# Altium schematic sheet iTag4.SchDoc
size A3
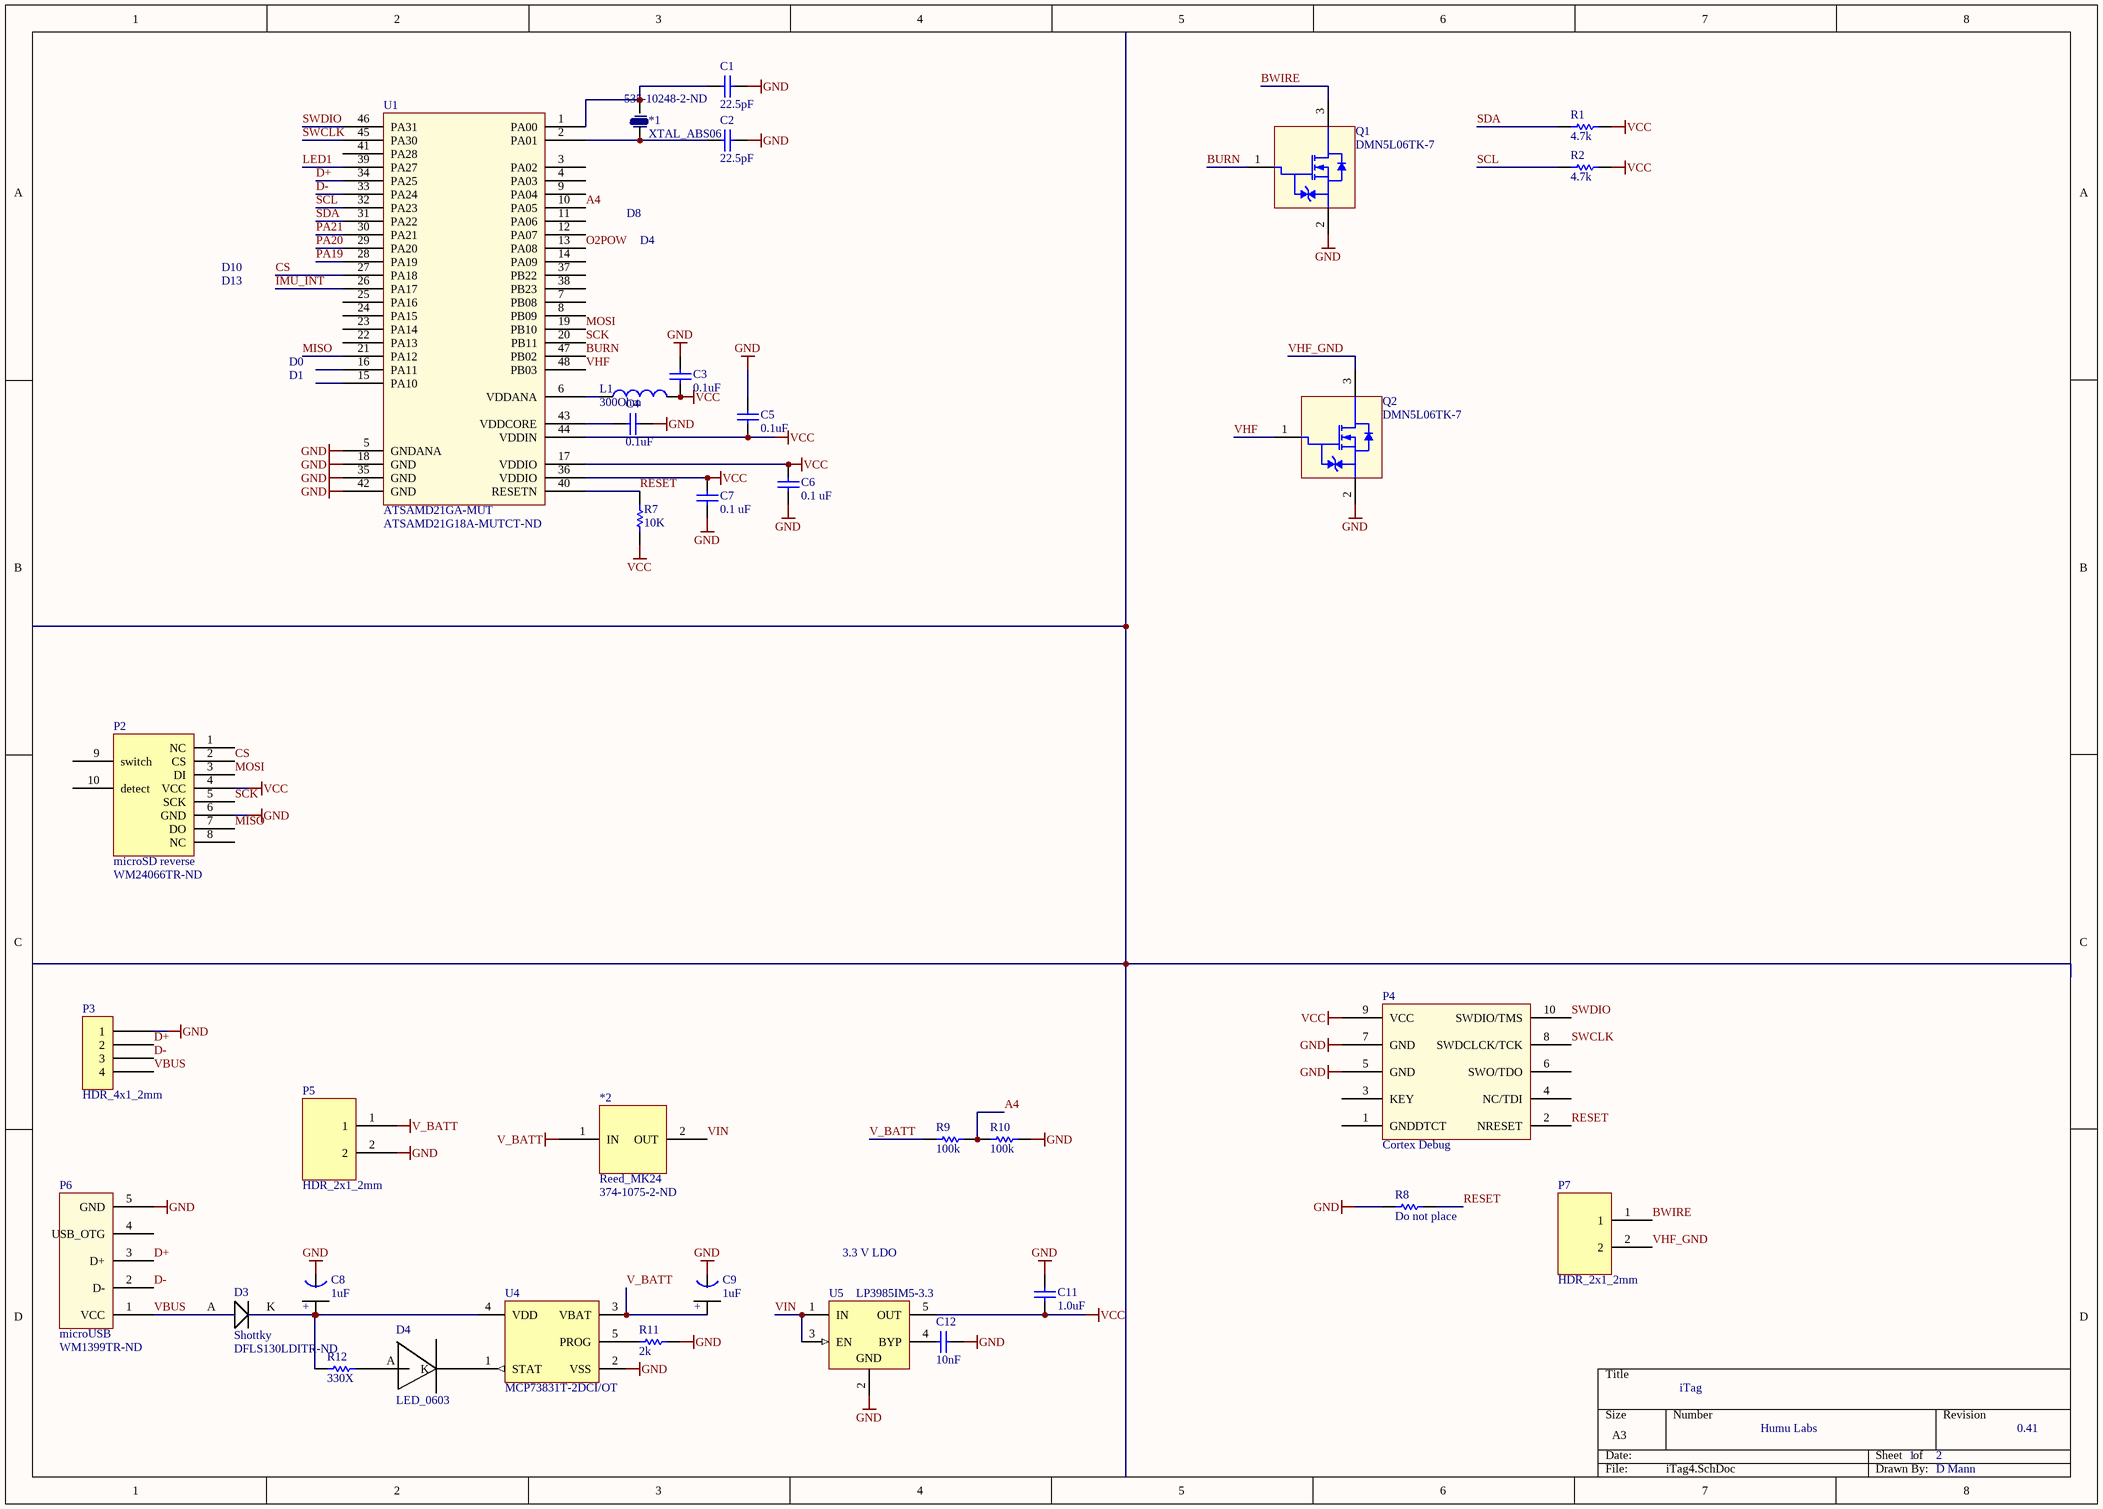
[diagram p0: iTag4.SchDoc]

## Parts
*1  XTAL_ABS06  Supplier Part Number 1: 535-10248-2-ND  [XTAL-ABS06]
*2  Reed_MK24  Supplier Part Number 1: 374-1075-2-ND  [Reed MK24-B-3]
C1  22.5pF  [0402]
C2  22.5pF  [0402]
C3  0.1uF  [0402]
C4  0.1uF  [0402]
C5  0.1uF  [0402]
C6  0.1 uF  [0402]
C7  0.1 uF  [0402]
C8  1uF  [Tant0805]
C9  1uF  [Tant0805]
C11  1.0uF  [0402]
C12  10nF  [0402]
D3  Shottky  Supplier Part Number 1: DFLS130LDITR-ND  [DFLS130]
D4  LED_0603  [Diode0603]
L1  300Ohm  [0805 (M2125) Ferrite]
P2  microSD reverse  Supplier Part Number 1: WM24066TR-ND  [miroSD_reverse]
P3  HDR_4x1_2mm  [Hdr_4x1_2mm]
P4  Cortex Debug  [Header_2x5_50mil]
P5  HDR_2x1_2mm  [HDR_2x1_2mm]
P6  microUSB  Supplier Part Number 1: WM1399TR-ND  [microUSB-B]
P7  HDR_2x1_2mm  [HDR_2x1_2mm]
Q1  DMN5L06TK-7  [SOT-523]
Q2  DMN5L06TK-7  [SOT-523]
R1  4.7k  [3-0603]
R2  4.7k  [3-0603]
R7  10K  [3-0603]
R8  Do not place  [3-0603]
R9  100k  [3-0603]
R10  100k  [3-0603]
R11  2k  [3-0603]
R12  330X  [3-0603]
U1  ATSAMD21GA-MUT  Supplier Part Number 1: ATSAMD21G18A-MUTCT-ND  [QFN127P600-8N]
U4  MCP73831T-2DCI/OT  [SOT-23-OT5_N]
U5  LP3985IM5-3.3  [MF05A_N]

## Nets
GND: C1.1 C2.1 C3.2 C4.2 C5.2 C6.2 C7.2 C8.1(GND) C9.1(GND) C11.2 C12.1 P2.6(GND) P3.1 P4.5(GND) P4.7(GND) P5.2 P6.5(GND) Q1.2(S) Q2.2(S) R8.2 R10.1 R11.1 U1.5(GNDANA) U1.18(GND) U1.35(GND) U1.42(GND) U4.2(VSS) U5.2(GND)
V_BATT: *2.1(IN) C9.2(+) P5.1 R9.2 U4.3(VBAT)
VCC: C3.1 C5.1 C6.1 C7.1 C11.1 L1.2 P2.4(VCC) P4.9(VCC) R1.1 R2.2 R7.1 U1.17(VDDIO) U1.36(VDDIO) U1.44(VDDIN) U5.5(OUT)
A4: R9.1 R10.2 U1.10(PA05)
BURN: Q1.1(G) U1.47(PB02)
BWIRE: P7.1 Q1.3(D)
CS: P2.2(CS) U1.27(PA18)
D+: P3.2 P6.3(D+) U1.34(PA25)
D-: P3.3 P6.2(D-) U1.33(PA24)
IMU_INT: U1.26(PA17)
LED1: U1.39(PA27)
MISO: P2.7(DO) U1.21(PA12)
MOSI: P2.3(DI) U1.19(PB10)
O2POW: U1.13(PA08)
PA19: U1.28(PA19)
PA20: U1.29(PA20)
PA21: U1.30(PA21)
RESET: P4.2(NRESET) R7.2 R8.1 U1.40(RESETN)
SCK: P2.5(SCK) U1.20(PB11)
SCL: R2.1 U1.32(PA23)
SDA: R1.2 U1.31(PA22)
SWCLK: P4.8(SWDCLCK/TCK) U1.45(PA30)
SWDIO: P4.10(SWDIO/TMS) U1.46(PA31)
VBUS: D3.A P3.4 P6.1(VCC)
VHF: Q2.1(G) U1.48(PB03)
VHF_GND: P7.2 Q2.3(D)
VIN: *2.2(OUT) U5.1(IN) U5.3(EN)
Net*1_1: *1.1 C2.2 U1.2(PA01)
Net*1_2: *1.2 C1.2 U1.1(PA00)
NetC4_1: C4.1 U1.43(VDDCORE)
NetC8_2: C8.2(+) D3.K R12.1 U4.4(VDD)
NetD4_A: D4.A R12.2
NetD4_K: D4.K U4.1(STAT)
NetL1_1: L1.1 U1.6(VDDANA)
NetR11_2: R11.2 U4.5(PROG)

Not connected (* = marked no-connect by the designer): C12 2; P2 1(NC) 8(NC) 9(switch) 10(detect); P4 1(GNDDTCT) 3(KEY) 4(NC/TDI) 6(SWO/TDO); P6 4(USB_OTG); U1 3(PA02) 4(PA03) 7(PB08) 8(PB09) 9(PA04) 11(PA06) 12(PA07) 14(PA09) 15(PA10) 16(PA11) 22(PA13) 23(PA14) 24(PA15) 25(PA16) 37(PB22) 38(PB23) 41(PA28); U5 4(BYP)

## Notes on the sheet
- D8
- D4
- D10
- D13
- D0
- D1
- 3.3 V LDO
- iTag
- Humu Labs
- 1
- 2
- 0.41
- D Mann

## Library data of the parts
C1 C2 = C0402: Ceramic Chip Capacitor - Standard; Note: Footprint corresponds to dimensions for bulk cassette packaging. This case size has tightened tolerances.; Value: 12.5; Published: 17-Jul-2002; LatestRevisionDate: 19-Mar-2004; LatestRevisionNote: Silkscreen size reduced.; DatasheetDocument: Mar-2001; PackageDocument: Mar-2001; PackageReference: 0402; Publisher: Altium Limited; Code_JEITA: 0402; Code_IPC: 1005 [0402]; ComponentLink1Description: Manufacturer Link; ComponentLink1URL: http://www.kemet.com/; ComponentLink2Description: Datasheet; ComponentLink2URL: http://www.kemet.com/kemet/web/homepage/kechome.nsf/vapubfilesname/F3102TA.pdf/$file/F3102TA.pdf
C3-C5 C11 C12 = C0402: Ceramic Chip Capacitor - Standard; Note: Footprint corresponds to dimensions for bulk cassette packaging. This case size has tightened tolerances.; Published: 17-Jul-2002; LatestRevisionDate: 19-Mar-2004; LatestRevisionNote: Silkscreen size reduced.; DatasheetDocument: Mar-2001; PackageDocument: Mar-2001; PackageReference: 0402; Publisher: Altium Limited; Code_JEITA: 0402; Code_IPC: 1005 [0402]; ComponentLink1Description: Manufacturer Link; ComponentLink1URL: http://www.kemet.com/; ComponentLink2Description: Datasheet; ComponentLink2URL: http://www.kemet.com/kemet/web/homepage/kechome.nsf/vapubfilesname/F3102TA.pdf/$file/F3102TA.pdf
  C3-C5: Value: 0.1uF
  C11: Value: 1.0uF
  C12: Value: 10nF
C6 C7 = C0402: Ceramic Chip Capacitor - Standard; Note: Footprint corresponds to dimensions for bulk cassette packaging. This case size has tightened tolerances.; Value: 0.1uF; Published: 17-Jul-2002; LatestRevisionDate: 19-Mar-2004; LatestRevisionNote: Silkscreen size reduced.; DatasheetDocument: Mar-2001; PackageDocument: Mar-2001; PackageReference: 0402; Publisher: Altium Limited; Code_JEITA: 0402; Code_IPC: 1005 [0402]; ComponentLink1Description: Manufacturer Link; ComponentLink1URL: http://www.kemet.com/; ComponentLink2Description: Datasheet; ComponentLink2URL: http://www.kemet.com/kemet/web/homepage/kechome.nsf/vapubfilesname/F3102TA.pdf/$file/F3102TA.pdf
C8 C9 = Tant0805: Value: *
D3 = DFLS130: Supplier 1: Digi-Key
L1 = Ferrite 0805(M2125) 3A: Ferrite 25mOhm@DC,  60 Ohm@100MHz; Fabrication Tested: NO; Creator and Date: Design Engineer's Name; Footprint Verified By: *; Schematic Verified By: *; Vendor Info Verified By: *; Value: 300Ohm; HelpURL: http://www.yuden.co.jp/ut/product/pdf/mlci08_e.pdf; Mass (place origin at center): *; Supplier 1: Digi-Key; Supplier Part Number 1: 587-1932-1-ND; Supplier 2: Newark; Supplier Part Number 2: 73M9170
P4 = CortexDebug
P6 = microUSB-B: Supplier 1: Digi-Key
Q1 Q2 = FET DMN5L06TK-7: Ultra-low leakage Enhanced MOSFET; Fabrication Tested: NO; Creator and Date: Will Flanery 2010-09-02; Footprint Verified By: *; Schematic Verified By: *; Vendor Info Verified By: *; Supplier 1: Digi-Key; Supplier Part Number 1: DMN5L06TKDICT-ND; HelpURL: http://www.diodes.com/datasheets/ds30926.pdf
R1 R2 R7-R12 = ERJ3RK: Precision Thick Film Chip Resistor, 10 Ohm to 1M Ohm Range, 1% and 0.5% Tolerance, 0603 Size, 0.063 W; Published: 17-Dec-2003; LatestRevisionDate: 19-Mar-2004; LatestRevisionNote: Silkscreen size reduced.; PackageDocument: Mar-2003; PackageReference: 3-0603; Publisher: Altium Limited; Code_IPC: 1608 [0603]; ComponentLink1Description: Manufacturer Link; ComponentLink1URL: http://www.panasonic.com/industrial/components/resistive_products.htm; ComponentLink2Description: Datasheet; ComponentLink2URL: http://www.panasonic.com/industrial/components/pdf/AOA0000CE2.pdf
U1 = ATSAMD21G18: Supplier 1: Digi-Key
U4 = MCP73831T-2DCI/OT: Miniature Single-Cell, Fully Integrated Li-Ion, Li-Polymer Charge Management Controller, 4.2V, 5-Pin SOT-23, Industrial Temperature, Tape and Reel; DatasheetVersion: revE, Sep-2008; PackageVersion: revBB, Aug-2009; PackageReference: SOT-23-OT5; PackageDescription: 5-Lead Plastic Small Outline Transistor (OT) [SOT-23]; Code_IPC: SOT23-5; ComponentLink1Description: Manufacturer URL; ComponentLink1URL: http://www.microchip.com/; ComponentLink2Description: Datasheet; ComponentLink2URL: http://ww1.microchip.com/downloads/en/DeviceDoc/21984e.pdf; ComponentLink3Description: Package Specification; ComponentLink3URL: http://www.microchip.com/stellent/groups/techpub_sg/documents/packagingspec/en012702.pdf
U5 = LP3985IM5-3.3: Micropower, 150mA Low-Noise Ultra Low-Dropout CMOS Voltage Regulator, 5-pin SOT-23; Manufacturer: National Semiconductor; CompType: LDO IC; PackageTopMarking: LDQB*XTT; PowerWise: N; Published: 4-Dec-2008; DatasheetVersion: Aug-2005; PackageVersion: revD, Aug-2008; PackageReference: MF05A; Publisher: Altium Limited; PackageDescription: Molded SOT-23, .115 x .063 x .040 in Body, 5 Lead, .0375 in Pitch; PartNumber: LP3985IM5-3.3; RoHS: N; PinCount: 5; ComponentLink1Description: LP3985 Datasheet; ComponentLink1URL: http://www.national.com/ds/LP/LP3985.pdf; ComponentLink2Description: LP3985 Web Page; ComponentLink2URL: http://www.national.com/pf/LP/LP3985.html; ComponentLink3Description: MF05A Package Page; ComponentLink3URL: http://www.national.com/packaging/folders/mf05a.html; Supplier 1: Farnell; Supplier Part Number 1: 4418694
*1 = XTAL_ABS06: Supplier 1: Digi-Key
*2 = Reed_MK24: Supplier 1: Digi-Key
P2 = microSD reverse: Supplier 1: Digi-Key